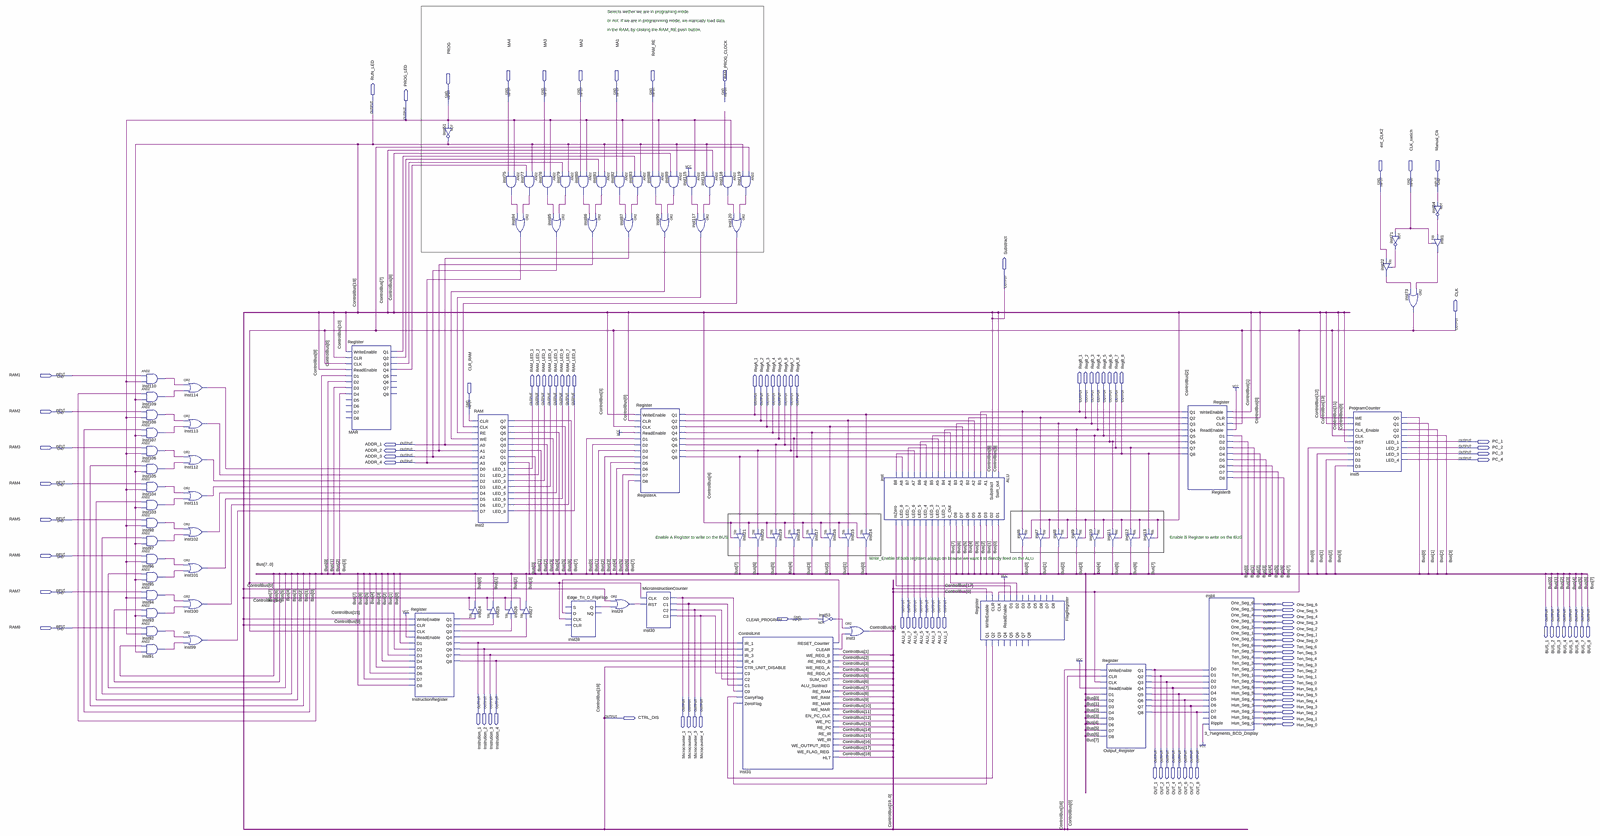
[diagram p0: schematic sheet, whole]
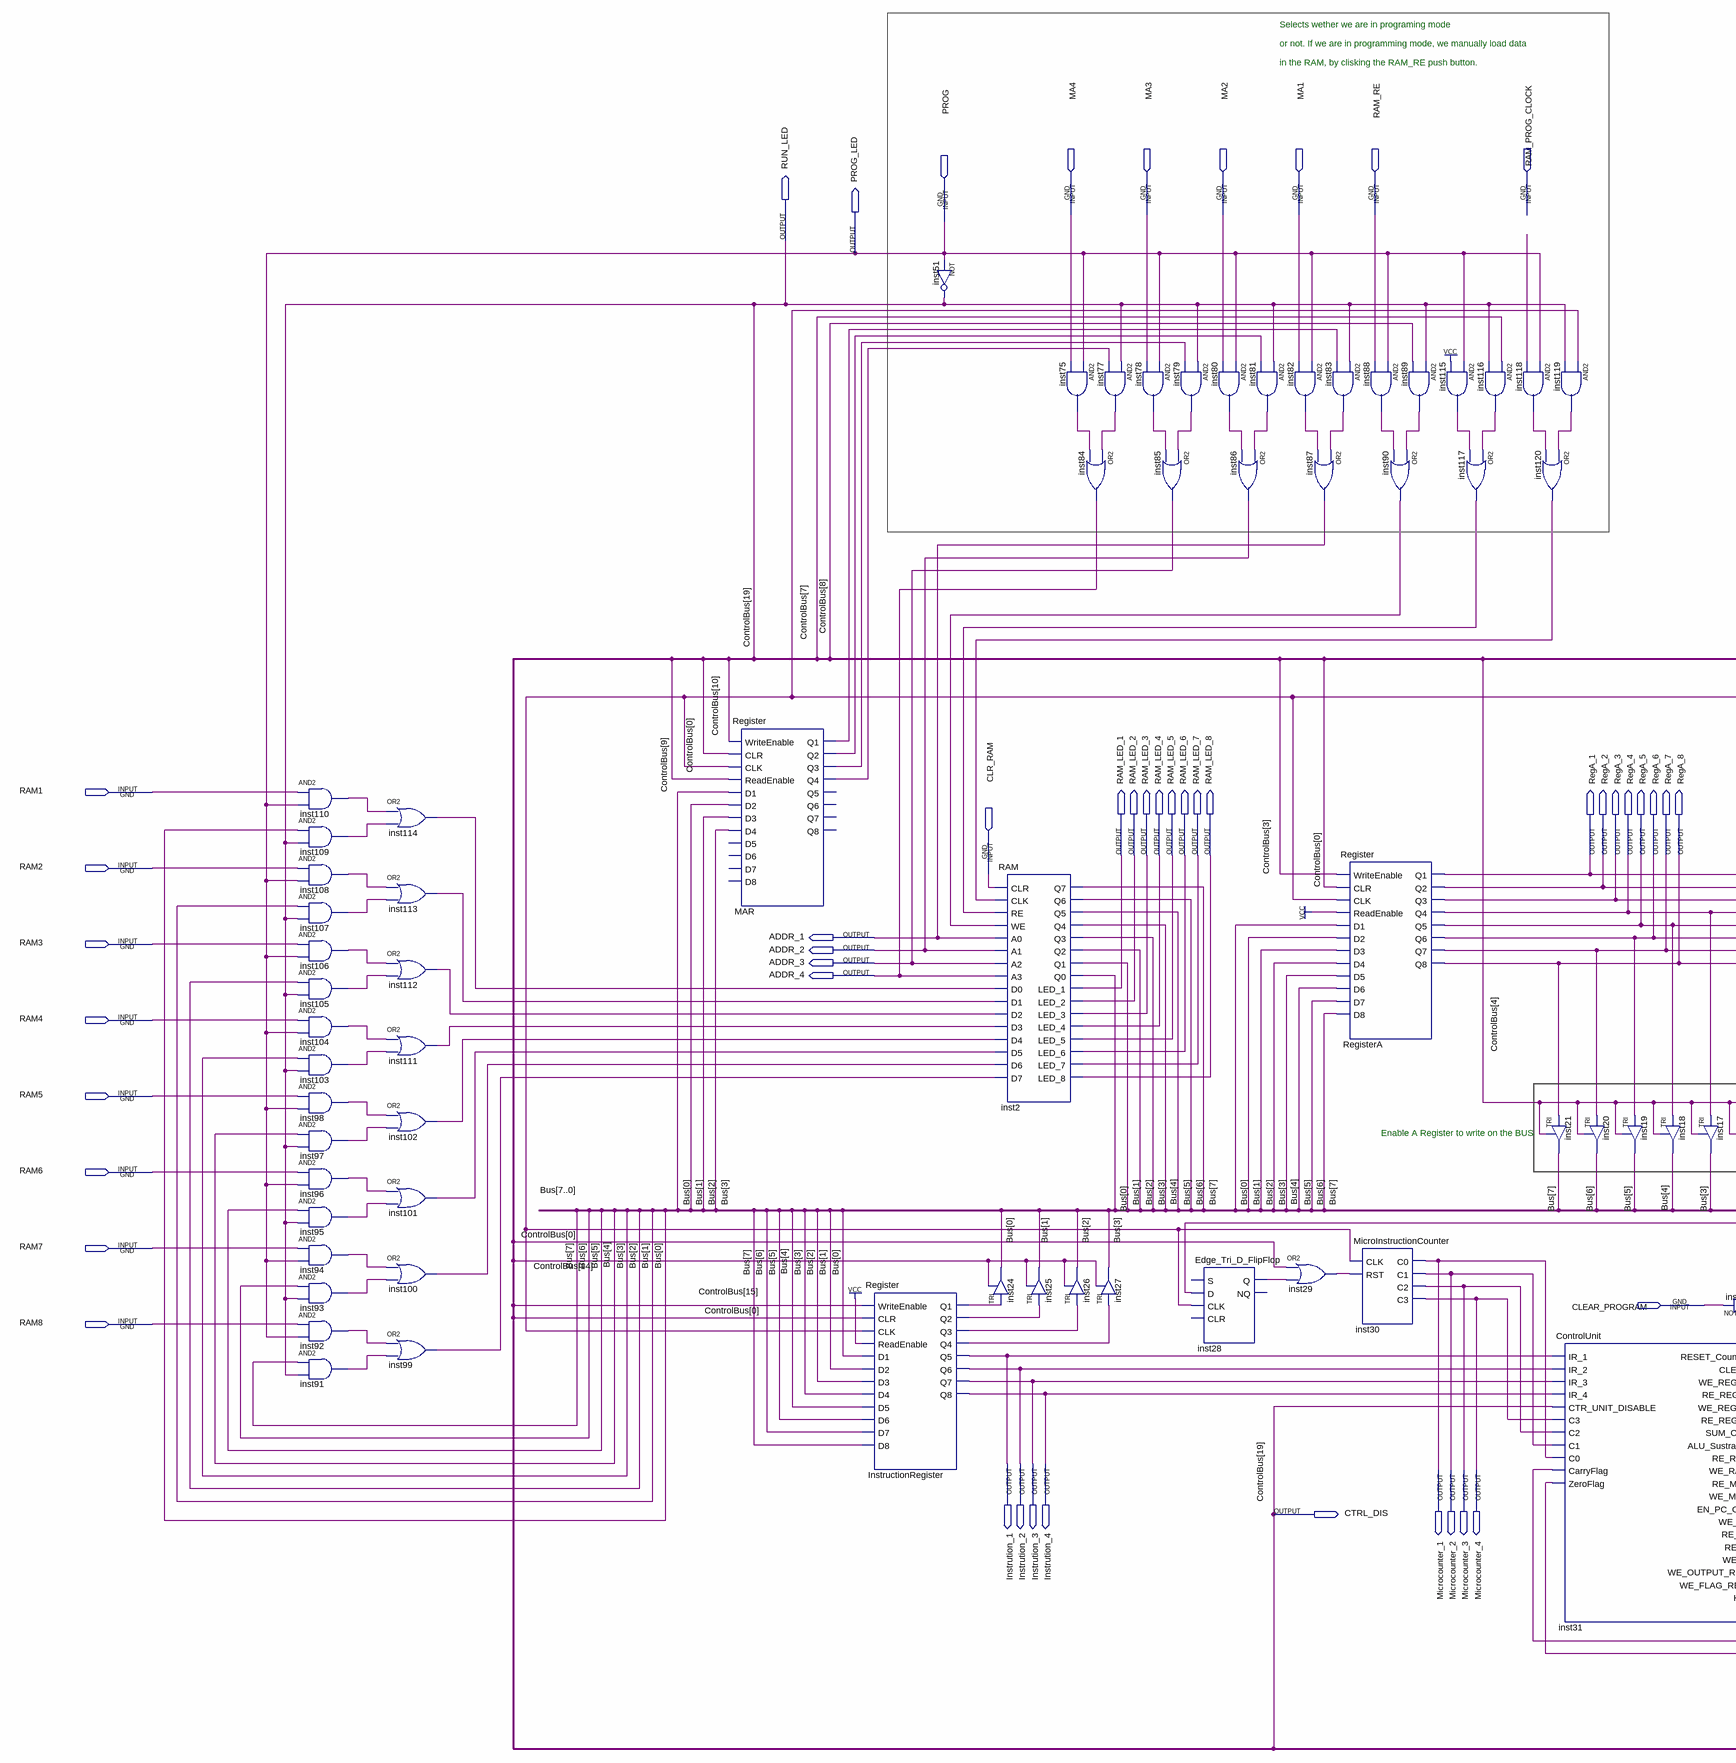
[diagram p1: schematic sheet, left part]
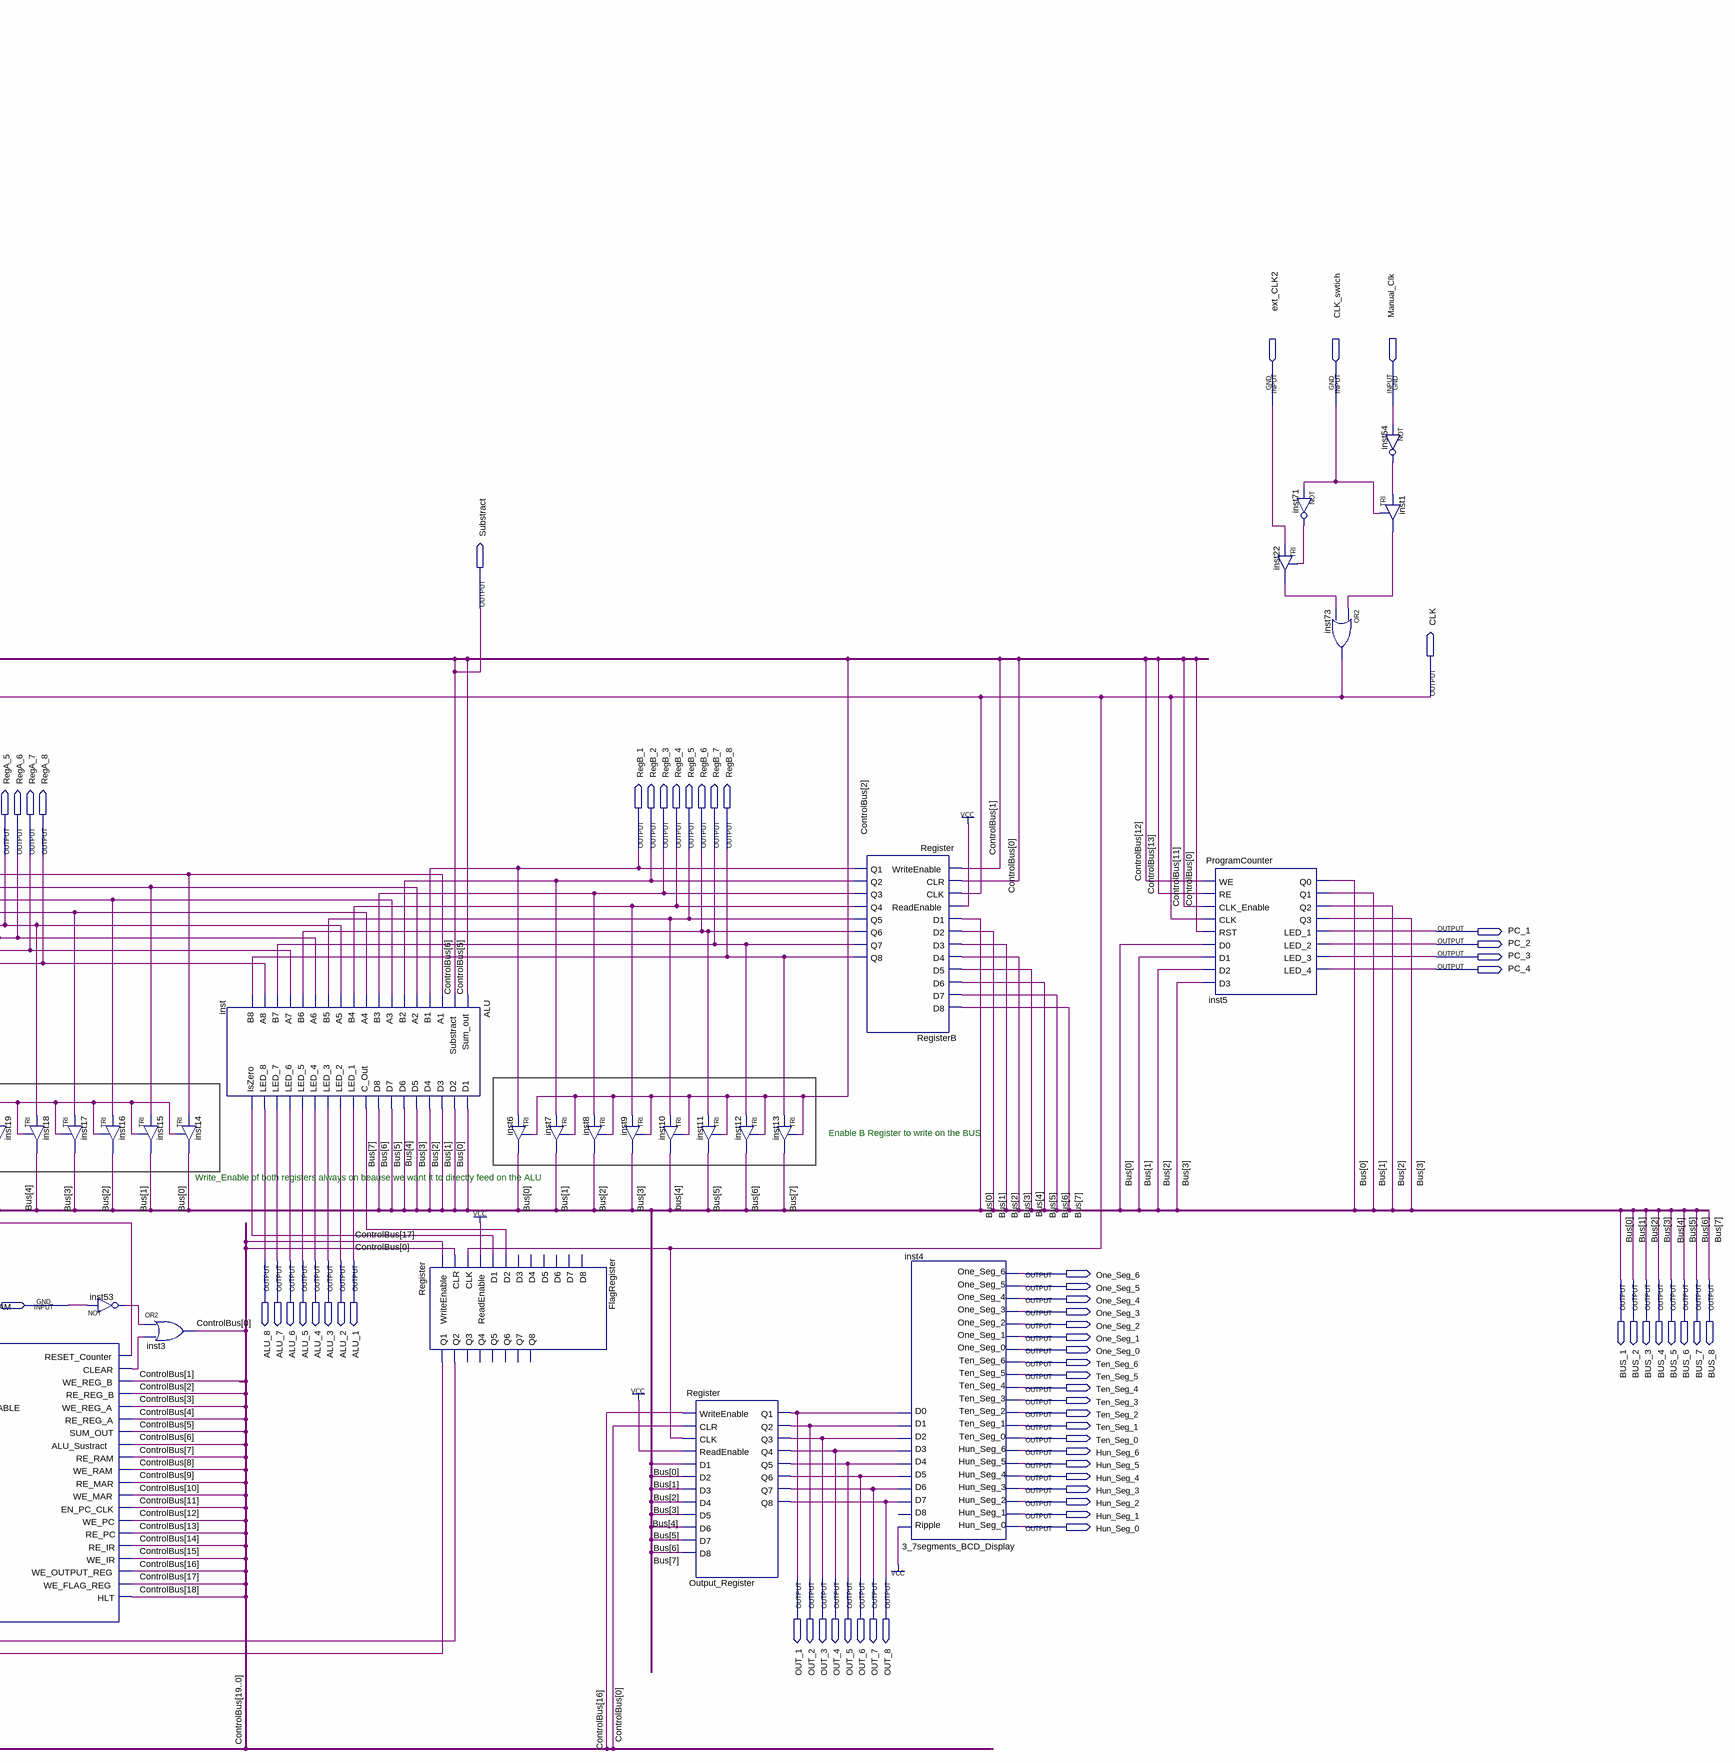
[diagram p2: schematic sheet, right part]
// Quartus schematic 8Bit_computer_diagram.bdf as structural Verilog: 87 symbols, 110 pins
module \8Bit_computer_diagram  (
  input  MA4,
  input  MA3,
  input  MA2,
  input  MA1,
  input  RAM_RE,
  input  RAM_PROG_CLOCK,
  input  PROG,
  input  ext_CLK2,
  input  CLK_swtich,
  input  Manual_Clk,
  input  RAM1,
  input  RAM2,
  input  CLR_RAM,
  input  RAM3,
  input  RAM4,
  input  RAM5,
  input  RAM6,
  input  RAM7,
  input  CLEAR_PROGRAM,
  input  RAM8,
  output RUN_LED,
  output PROG_LED,
  output Substract,
  output CLK,
  output RegB_1,
  output RegB_2,
  output RegB_3,
  output RegB_4,
  output RegB_5,
  output RegB_6,
  output RegB_7,
  output RegB_8,
  output RAM_LED_1,
  output RAM_LED_2,
  output RAM_LED_3,
  output RAM_LED_4,
  output RAM_LED_5,
  output RAM_LED_6,
  output RAM_LED_7,
  output RAM_LED_8,
  output RegA_1,
  output RegA_2,
  output RegA_3,
  output RegA_4,
  output RegA_5,
  output RegA_6,
  output RegA_7,
  output RegA_8,
  output PC_1,
  output ADDR_1,
  output PC_2,
  output ADDR_2,
  output PC_3,
  output ADDR_3,
  output PC_4,
  output ADDR_4,
  output ALU_8,
  output ALU_7,
  output ALU_6,
  output ALU_5,
  output ALU_4,
  output ALU_3,
  output ALU_2,
  output ALU_1,
  output One_Seg_6,
  output BUS_1,
  output BUS_2,
  output BUS_3,
  output BUS_4,
  output BUS_5,
  output BUS_6,
  output BUS_7,
  output BUS_8,
  output One_Seg_5,
  output One_Seg_4,
  output One_Seg_3,
  output One_Seg_2,
  output One_Seg_1,
  output One_Seg_0,
  output Ten_Seg_6,
  output Ten_Seg_5,
  output Ten_Seg_4,
  output Ten_Seg_3,
  output Ten_Seg_2,
  output Ten_Seg_1,
  output Ten_Seg_0,
  output Hun_Seg_6,
  output Instrution_1,
  output Instrution_2,
  output Instrution_3,
  output Instrution_4,
  output Hun_Seg_5,
  output Microcounter_1,
  output Microcounter_2,
  output Microcounter_3,
  output Microcounter_4,
  output Hun_Seg_4,
  output Hun_Seg_3,
  output Hun_Seg_2,
  output CTRL_DIS,
  output Hun_Seg_1,
  output Hun_Seg_0,
  output OUT_1,
  output OUT_2,
  output OUT_3,
  output OUT_4,
  output OUT_5,
  output OUT_6,
  output OUT_7,
  output OUT_8
);

  wire FlagRegister_q1, FlagRegister_q2, inst1_out, inst22_out, inst28_q, inst29_out, inst31_clear,
       inst31_reset_counter, inst53_out, inst54_out, inst71_out, inst75_out, inst77_out, inst78_out,
       inst79_out, inst80_out, inst81_out, inst82_out, inst83_out, inst88_out, inst89_out, inst90_out,
       inst91_out, inst92_out, inst93_out, inst94_out, inst95_out, inst96_out, inst97_out, inst98_out,
       inst99_out, inst100_out, inst101_out, inst102_out, inst103_out, inst104_out, inst105_out, inst106_out,
       inst107_out, inst108_out, inst109_out, inst110_out, inst111_out, inst112_out, inst113_out,
       inst114_out, inst115_out, inst116_out, inst117_out, inst118_out, inst119_out, inst120_out, inst_c_out,
       inst_iszero, InstructionRegister_q1, InstructionRegister_q2, InstructionRegister_q3,
       InstructionRegister_q4, MAR_q1, MAR_q2, MAR_q3, MAR_q4, undriven;
  wire [18:0] ControlBus;

  and inst110 (inst110_out, RAM1, PROG);
  and inst109 (inst109_out, BUS_1, CTRL_DIS);
  and inst108 (inst108_out, RAM2, PROG);
  and inst107 (inst107_out, BUS_2, CTRL_DIS);
  and inst106 (inst106_out, RAM3, PROG);
  and inst105 (inst105_out, BUS_3, CTRL_DIS);
  and inst104 (inst104_out, RAM4, PROG);
  and inst103 (inst103_out, BUS_4, CTRL_DIS);
  and inst98 (inst98_out, RAM5, PROG);
  and inst97 (inst97_out, BUS_5, CTRL_DIS);
  and inst96 (inst96_out, RAM6, PROG);
  and inst95 (inst95_out, BUS_6, CTRL_DIS);
  and inst94 (inst94_out, RAM7, PROG);
  and inst93 (inst93_out, BUS_7, CTRL_DIS);
  and inst92 (inst92_out, RAM8, PROG);
  and inst91 (inst91_out, BUS_8, CTRL_DIS);
  or inst114 (inst114_out, inst110_out, inst109_out);
  or inst113 (inst113_out, inst108_out, inst107_out);
  or inst112 (inst112_out, inst106_out, inst105_out);
  or inst111 (inst111_out, inst104_out, inst103_out);
  or inst102 (inst102_out, inst98_out, inst97_out);
  or inst101 (inst101_out, inst96_out, inst95_out);
  or inst100 (inst100_out, inst94_out, inst93_out);
  or inst99 (inst99_out, inst92_out, inst91_out);
  Register MAR (
    .WriteEnable(ControlBus[10]), .CLR(ControlBus[0]), .CLK(CLK), .ReadEnable(ControlBus[9]), .D1(BUS_1),
    .D2(BUS_2), .D3(BUS_3), .D4(BUS_4), .Q1(MAR_q1), .Q2(MAR_q2), .Q3(MAR_q3), .Q4(MAR_q4));  // open: D5, D6, D7, D8, Q5, Q6, Q7, Q8
  Register InstructionRegister (
    .WriteEnable(ControlBus[15]), .CLR(ControlBus[0]), .CLK(CLK), .ReadEnable(1'b1), .D1(BUS_1), .D2(BUS_2),
    .D3(BUS_3), .D4(BUS_4), .D5(BUS_5), .D6(BUS_6), .D7(BUS_7), .D8(BUS_8), .Q1(InstructionRegister_q1),
    .Q2(InstructionRegister_q2), .Q3(InstructionRegister_q3), .Q4(InstructionRegister_q4), .Q5(Instrution_1),
    .Q6(Instrution_2), .Q7(Instrution_3), .Q8(Instrution_4));
  not inst51 (CTRL_DIS, PROG);
  TRI inst24 (.IN(InstructionRegister_q1), .OE(ControlBus[14]), .OUT(BUS_1));
  RAM inst2 (
    .CLR(CLR_RAM), .CLK(inst120_out), .RE(inst117_out), .WE(inst90_out), .A0(ADDR_1), .A1(ADDR_2),
    .A2(ADDR_3), .A3(ADDR_4), .D0(inst114_out), .D1(inst113_out), .D2(inst112_out), .D3(inst111_out),
    .D4(inst102_out), .D5(inst101_out), .D6(inst100_out), .D7(inst99_out), .Q7(BUS_8), .Q6(BUS_7),
    .Q5(BUS_6), .Q4(BUS_5), .Q3(BUS_4), .Q2(BUS_3), .Q1(BUS_2), .Q0(BUS_1), .LED_1(RAM_LED_1),
    .LED_2(RAM_LED_2), .LED_3(RAM_LED_3), .LED_4(RAM_LED_4), .LED_5(RAM_LED_5), .LED_6(RAM_LED_6),
    .LED_7(RAM_LED_7), .LED_8(RAM_LED_8));
  TRI inst25 (.IN(InstructionRegister_q2), .OE(ControlBus[14]), .OUT(BUS_2));
  and inst75 (inst75_out, PROG, MA4);
  or inst84 (ADDR_4, inst77_out, inst75_out);
  TRI inst26 (.IN(InstructionRegister_q3), .OE(ControlBus[14]), .OUT(BUS_3));
  and inst77 (inst77_out, CTRL_DIS, MAR_q4);
  and inst78 (inst78_out, PROG, MA3);
  TRI inst27 (.IN(InstructionRegister_q4), .OE(ControlBus[14]), .OUT(BUS_4));
  and inst79 (inst79_out, CTRL_DIS, MAR_q3);
  or inst85 (ADDR_3, inst79_out, inst78_out);
  Edge_Tri_D_FlipFlop inst28 (.D(inst31_reset_counter), .CLK(CLK), .Q(inst28_q));  // open: S, CLR, NQ
  and inst80 (inst80_out, PROG, MA2);
  or inst86 (ADDR_2, inst81_out, inst80_out);
  and inst81 (inst81_out, CTRL_DIS, MAR_q2);
  and inst82 (inst82_out, PROG, MA1);
  or inst29 (inst29_out, ControlBus[0], inst28_q);
  and inst83 (inst83_out, CTRL_DIS, MAR_q1);
  or inst87 (ADDR_1, inst83_out, inst82_out);
  Register RegisterA (
    .WriteEnable(ControlBus[3]), .CLR(ControlBus[0]), .CLK(CLK), .ReadEnable(1'b1), .D1(BUS_1), .D2(BUS_2),
    .D3(BUS_3), .D4(BUS_4), .D5(BUS_5), .D6(BUS_6), .D7(BUS_7), .D8(BUS_8), .Q1(RegA_1), .Q2(RegA_2),
    .Q3(RegA_3), .Q4(RegA_4), .Q5(RegA_5), .Q6(RegA_6), .Q7(RegA_7), .Q8(RegA_8));
  and inst88 (inst88_out, PROG, RAM_RE);
  or inst90 (inst90_out, inst89_out, inst88_out);
  MicroInstructionCounter inst30 (
    .CLK(CLK), .RST(inst29_out), .C0(Microcounter_1), .C1(Microcounter_2), .C2(Microcounter_3),
    .C3(Microcounter_4));
  and inst89 (inst89_out, CTRL_DIS, ControlBus[8]);
  and inst115 (inst115_out, PROG, 1'b1);
  and inst116 (inst116_out, ControlBus[7], CTRL_DIS);
  or inst117 (inst117_out, inst116_out, inst115_out);
  and inst118 (inst118_out, PROG, undriven);
  or inst120 (inst120_out, inst119_out, inst118_out);
  TRI inst21 (.IN(RegA_8), .OE(ControlBus[4]), .OUT(BUS_8));
  and inst119 (inst119_out, CLK, CTRL_DIS);
  TRI inst20 (.IN(RegA_7), .OE(ControlBus[4]), .OUT(BUS_7));
  ControlUnit inst31 (
    .IR_1(Instrution_1), .IR_2(Instrution_2), .IR_3(Instrution_3), .IR_4(Instrution_4),
    .CTR_UNIT_DISABLE(CTRL_DIS), .C3(Microcounter_4), .C2(Microcounter_3), .C1(Microcounter_2),
    .C0(Microcounter_1), .CarryFlag(FlagRegister_q2), .ZeroFlag(FlagRegister_q1),
    .RESET_Counter(inst31_reset_counter), .CLEAR(inst31_clear), .WE_REG_B(ControlBus[1]),
    .RE_REG_B(ControlBus[2]), .WE_REG_A(ControlBus[3]), .RE_REG_A(ControlBus[4]), .SUM_OUT(ControlBus[5]),
    .ALU_Sustract(Substract), .RE_RAM(ControlBus[7]), .WE_RAM(ControlBus[8]), .RE_MAR(ControlBus[9]),
    .WE_MAR(ControlBus[10]), .EN_PC_CLK(ControlBus[11]), .WE_PC(ControlBus[12]), .RE_PC(ControlBus[13]),
    .RE_IR(ControlBus[14]), .WE_IR(ControlBus[15]), .WE_OUTPUT_REG(ControlBus[16]),
    .WE_FLAG_REG(ControlBus[17]), .HLT(ControlBus[18]));
  TRI inst19 (.IN(RegA_6), .OE(ControlBus[4]), .OUT(BUS_6));
  TRI inst17 (.IN(RegA_4), .OE(ControlBus[4]), .OUT(BUS_4));
  TRI inst18 (.IN(RegA_5), .OE(ControlBus[4]), .OUT(BUS_5));
  TRI inst16 (.IN(RegA_3), .OE(ControlBus[4]), .OUT(BUS_3));
  not inst53 (inst53_out, CLEAR_PROGRAM);
  TRI inst15 (.IN(RegA_2), .OE(ControlBus[4]), .OUT(BUS_2));
  or inst3 (ControlBus[0], inst53_out, inst31_clear);
  ALU inst (
    .Sum_out(ControlBus[5]), .Substract(Substract), .A1(RegA_1), .B1(RegB_1), .A2(RegA_2), .B2(RegB_2),
    .A3(RegA_3), .B3(RegB_3), .A4(RegA_4), .B4(RegB_4), .A5(RegA_5), .B5(RegB_5), .A6(RegA_6), .B6(RegB_6),
    .A7(RegA_7), .B7(RegB_7), .A8(RegA_8), .B8(RegB_8), .D1(BUS_1), .D2(BUS_2), .D3(BUS_3), .D4(BUS_4),
    .D5(BUS_5), .D6(BUS_6), .D7(BUS_7), .D8(BUS_8), .C_Out(inst_c_out), .LED_1(ALU_1), .LED_2(ALU_2),
    .LED_3(ALU_3), .LED_4(ALU_4), .LED_5(ALU_5), .LED_6(ALU_6), .LED_7(ALU_7), .LED_8(ALU_8),
    .IsZero(inst_iszero));
  TRI inst14 (.IN(RegA_1), .OE(ControlBus[4]), .OUT(BUS_1));
  Register FlagRegister (
    .WriteEnable(ControlBus[17]), .CLR(ControlBus[0]), .CLK(CLK), .ReadEnable(1'b1), .D1(inst_iszero),
    .D2(inst_c_out), .Q1(FlagRegister_q1), .Q2(FlagRegister_q2));  // open: D3, D4, D5, D6, D7, D8, Q3, Q4, Q5, Q6, Q7, Q8
  TRI inst6 (.IN(RegB_1), .OE(ControlBus[2]), .OUT(BUS_1));
  TRI inst7 (.IN(RegB_2), .OE(ControlBus[2]), .OUT(BUS_2));
  TRI inst8 (.IN(RegB_3), .OE(ControlBus[2]), .OUT(BUS_3));
  TRI inst9 (.IN(RegB_4), .OE(ControlBus[2]), .OUT(BUS_4));
  TRI inst10 (.IN(RegB_5), .OE(ControlBus[2]), .OUT(BUS_5));
  TRI inst11 (.IN(RegB_6), .OE(ControlBus[2]), .OUT(BUS_6));
  Register Output_Register (
    .WriteEnable(ControlBus[16]), .CLR(ControlBus[0]), .CLK(CLK), .ReadEnable(1'b1), .D1(BUS_1), .D2(BUS_2),
    .D3(BUS_3), .D4(BUS_4), .D5(BUS_5), .D6(BUS_6), .D7(BUS_7), .D8(BUS_8), .Q1(OUT_1), .Q2(OUT_2),
    .Q3(OUT_3), .Q4(OUT_4), .Q5(OUT_5), .Q6(OUT_6), .Q7(OUT_7), .Q8(OUT_8));
  TRI inst12 (.IN(RegB_7), .OE(ControlBus[2]), .OUT(BUS_7));
  TRI inst13 (.IN(RegB_8), .OE(ControlBus[2]), .OUT(BUS_8));
  Register RegisterB (
    .WriteEnable(ControlBus[1]), .CLR(ControlBus[0]), .CLK(CLK), .ReadEnable(1'b1), .D1(BUS_1), .D2(BUS_2),
    .D3(BUS_3), .D4(BUS_4), .D5(BUS_5), .D6(BUS_6), .D7(BUS_7), .D8(BUS_8), .Q1(RegB_1), .Q2(RegB_2),
    .Q3(RegB_3), .Q4(RegB_4), .Q5(RegB_5), .Q6(RegB_6), .Q7(RegB_7), .Q8(RegB_8));
  \3_7segments_BCD_Display  inst4 (
    .Ripple(1'b1), .D7(OUT_8), .D6(OUT_7), .D5(OUT_6), .D4(OUT_5), .D3(OUT_4), .D2(OUT_3), .D1(OUT_2),
    .D0(OUT_1), .Hun_Seg_0(Hun_Seg_0), .Hun_Seg_1(Hun_Seg_1), .Hun_Seg_2(Hun_Seg_2), .Hun_Seg_3(Hun_Seg_3),
    .Hun_Seg_4(Hun_Seg_4), .Hun_Seg_5(Hun_Seg_5), .Hun_Seg_6(Hun_Seg_6), .Ten_Seg_0(Ten_Seg_0),
    .Ten_Seg_1(Ten_Seg_1), .Ten_Seg_2(Ten_Seg_2), .Ten_Seg_3(Ten_Seg_3), .Ten_Seg_4(Ten_Seg_4),
    .Ten_Seg_5(Ten_Seg_5), .Ten_Seg_6(Ten_Seg_6), .One_Seg_0(One_Seg_0), .One_Seg_1(One_Seg_1),
    .One_Seg_2(One_Seg_2), .One_Seg_3(One_Seg_3), .One_Seg_4(One_Seg_4), .One_Seg_5(One_Seg_5),
    .One_Seg_6(One_Seg_6));  // open: D8
  ProgramCounter inst5 (
    .WE(ControlBus[12]), .RE(ControlBus[13]), .CLK_Enable(ControlBus[11]), .CLK(CLK), .RST(ControlBus[0]),
    .D0(BUS_1), .D1(BUS_2), .D2(BUS_3), .D3(BUS_4), .Q0(BUS_1), .Q1(BUS_2), .Q2(BUS_3), .Q3(BUS_4),
    .LED_1(PC_1), .LED_2(PC_2), .LED_3(PC_3), .LED_4(PC_4));
  TRI inst22 (.IN(ext_CLK2), .OE(inst71_out), .OUT(inst22_out));
  not inst71 (inst71_out, CLK_swtich);
  or inst73 (CLK, inst1_out, inst22_out);
  not inst54 (inst54_out, Manual_Clk);
  TRI inst1 (.IN(inst54_out), .OE(CLK_swtich), .OUT(inst1_out));

  assign PROG_LED = PROG;
  assign RUN_LED = CTRL_DIS;

  // Other names for the same wires on the sheet: Bus[7:0] = {BUS_8, BUS_7, BUS_6, BUS_5, BUS_4, BUS_3, BUS_2, BUS_1};
  //   ControlBus (some bits) = {CTRL_DIS, Substract}

  // Notes on the sheet:
  //   Selects wether we are in programing mode
  //   or not. If we are in programming mode, we manually load data
  //   in the RAM, by clisking the RAM_RE push button.
  //   Enable A Register to write on the BUS
  //   Enable B Register to write on the BUS
  //   Write_Enable of both registers always on beause we want it to directly feed on the ALU
endmodule
